# EasyEDA Pro project ProDoc_Schematic1_2024-11-27.epro

# Schematic Schematic1
Board Name: Board1; Create Date: 2024-10-19; Page Name: P1; Project Name: 3070; Schematic Name: Schematic1; Update Date: 2024-10-19; Company: EE3070_L02_Group4; Page Size: A4; Version: V1.0
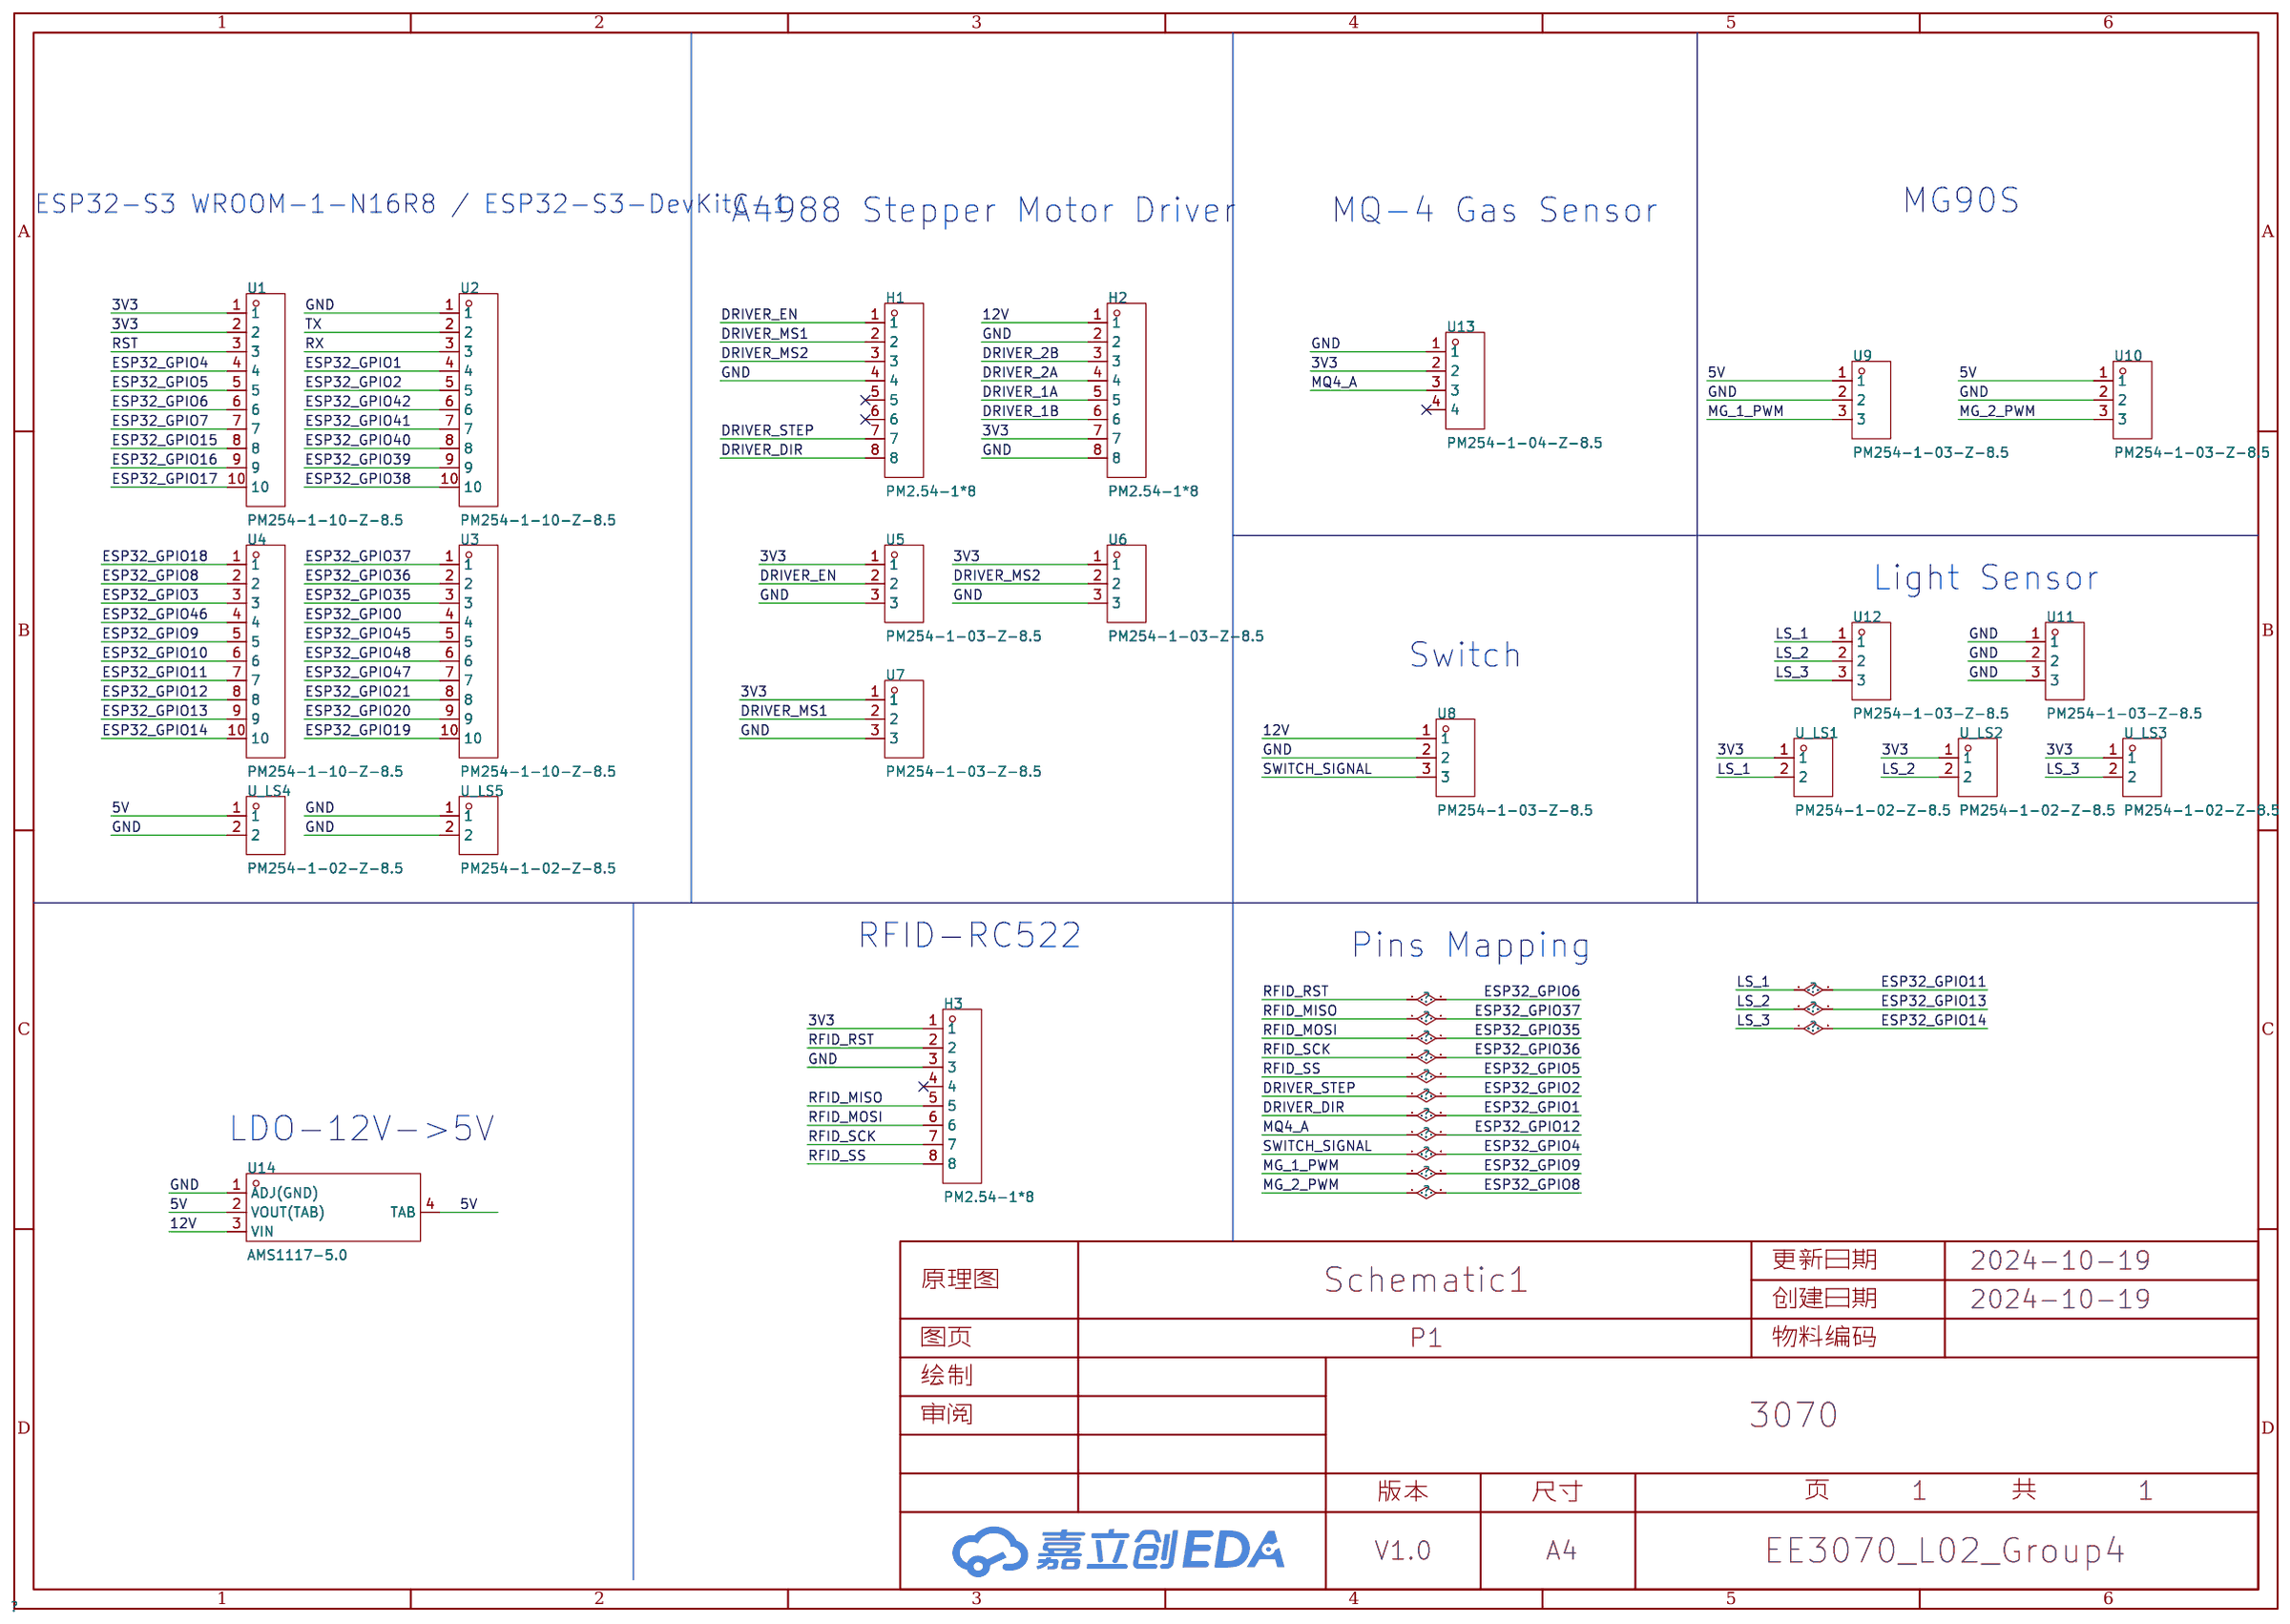
[diagram p0: schematic sheet]

## Parts
H1  PM2.54-1*8  [HDR-TH_8P-P2.54-V-F]
H2  PM2.54-1*8  [HDR-TH_8P-P2.54-V-F]
H3  PM2.54-1*8  [HDR-TH_8P-P2.54-V-F]
U1  PM254-1-10-Z-8.5  [hdr-th_10p-p2.54-v-f]
U2  PM254-1-10-Z-8.5  [hdr-th_10p-p2.54-v-f]
U3  PM254-1-10-Z-8.5  [hdr-th_10p-p2.54-v-f]
U4  PM254-1-10-Z-8.5  [hdr-th_10p-p2.54-v-f]
U5  PM254-1-03-Z-8.5  [HDR-TH_3P-P2.54-V-F]
U6  PM254-1-03-Z-8.5  [HDR-TH_3P-P2.54-V-F]
U7  PM254-1-03-Z-8.5  [HDR-TH_3P-P2.54-V-F]
U8  PM254-1-03-Z-8.5  [HDR-TH_3P-P2.54-V-F]
U9  PM254-1-03-Z-8.5  [HDR-TH_3P-P2.54-V-F]
U10  PM254-1-03-Z-8.5  [HDR-TH_3P-P2.54-V-F]
U11  PM254-1-03-Z-8.5  [HDR-TH_3P-P2.54-V-F]
U12  PM254-1-03-Z-8.5  [HDR-TH_3P-P2.54-V-F]
U13  PM254-1-04-Z-8.5  [HDR-TH_4P-P2.54-V-M]
U14  AMS1117-5.0  [SOT-223_L6.7-W3.5-P2.30-BR]
U_LS1  PM254-1-02-Z-8.5  [HDR-TH_2P-P2.54-V-F]
U_LS2  PM254-1-02-Z-8.5  [HDR-TH_2P-P2.54-V-F]
U_LS3  PM254-1-02-Z-8.5  [HDR-TH_2P-P2.54-V-F]
U_LS4  PM254-1-02-Z-8.5  [HDR-TH_2P-P2.54-V-F]
U_LS5  PM254-1-02-Z-8.5  [HDR-TH_2P-P2.54-V-F]

## Library data of the parts
H1-H3 = PM2.54-1*8: 插孔结构:1x8P;间距:2.54mm;行距:2.54mm;圆孔/方孔:方孔;安装类型:直插;排数:单排;总孔位数:8P;额定电流:2.5A;插孔方向:顶部;塑高:8.5mm;工作温度范围:-40℃~+105℃;; LCSC Part Name: 间距:2.54mm 1x8P 直插; Supplier Part: C5224027; Manufacturer: ZHOURI(洲日); Supplier Footprint: 插件,P=2.54mm; JLCPCB Part Class: 扩展库; Datasheet: https://atta.szlcsc.com/upload/public/pdf/source/20221031/E5BAE727A502DC7C69CE947E807E2296.pdf; Supplier: LCSC; Holes Structure: 1x8P; Pitch: 2.54mm; Row Spacing: 2.54mm; Circular Hole / Square Hole: 方孔; Mounting Type: 直插; Number of Rows: 单排; Number of Holes: 8P; Current Rating (Max): 2.5A; Holes Direction: 顶部; Insulation Height: 8.5mm; Operating Temperature Range: -40℃~+105℃
U1-U4 = PM254-1-10-Z-8.5: 插孔结构:1x10P;间距:2.54mm;行距:-;圆孔/方孔:方孔;安装类型:直插;排数:单排;总孔位数:10P;额定电流:3A;额定电压:-;插孔方向:顶部;塑高:8.5mm;触头材质:铜合金;工作温度范围:-40℃~+105℃;焊接温度(最大值):260℃@5S;; LCSC Part Name: 1x10P 间距:2.54mm 直插; Supplier Part: C2897373; Manufacturer: HCTL(华灿天禄); Supplier Footprint: 插件,P=2.54mm; JLCPCB Part Class: Extended Part; Datasheet: https://atta.szlcsc.com/upload/public/pdf/source/20230609/534BE42964C679BDE98E061007C4ABD6.pdf; Supplier: LCSC; Holes Structure: 1x10P; Pitch: 2.54mm; Circular Hole / Square Hole: 方孔; Mounting Type: 直插; Number of Rows: 单排; Number of Holes: 10P; Current Rating (Max): 3A; Holes Direction: 顶部; Insulation Height: 8.5mm; Contact Material: 铜合金; Operating Temperature Range: -40℃~+105℃; Soldering Temperature(Max): 260℃@5S
U5-U12 = PM254-1-03-Z-8.5: 插孔结构:1x3P;间距:2.54mm;行距:-;圆孔/方孔:方孔;安装类型:直插;排数:单排;总孔位数:3P;额定电流:3A;额定电压:-;插孔方向:顶部;塑高:8.5mm;触头材质:铜合金;工作温度范围:-40℃~+105℃;焊接温度(最大值):260℃@5S;; LCSC Part Name: 1x3P 间距:2.54mm 直插; Supplier Part: C2897366; Manufacturer: HCTL(华灿天禄); Supplier Footprint: 插件,P=2.54mm; JLCPCB Part Class: 扩展库; Datasheet: https://atta.szlcsc.com/upload/public/pdf/source/20230609/534BE42964C679BDE98E061007C4ABD6.pdf; Supplier: LCSC; Holes Structure: 1x3P; Pitch: 2.54mm; Circular Hole / Square Hole: 方孔; Mounting Type: 直插; Number of Rows: 单排; Number of Holes: 3P; Current Rating (Max): 3A; Holes Direction: 顶部; Insulation Height: 8.5mm; Contact Material: 铜合金; Operating Temperature Range: -40℃~+105℃; Soldering Temperature(Max): 260℃@5S
U13 = PM254-1-04-Z-8.5_C2897367: 插孔结构:1x4P;间距:2.54mm;行距:-;圆孔/方孔:方孔;安装类型:直插;排数:单排;总孔位数:4P;额定电流:3A;额定电压:-;插孔方向:顶部;塑高:8.5mm;触头材质:铜合金;工作温度范围:-40℃~+105℃;焊接温度(最大值):260℃@5S;; LCSC Part Name: 1x4P 间距:2.54mm 直插; Supplier Part: C2897367; Manufacturer: HCTL(华灿天禄); Supplier Footprint: 插件,P=2.54mm; JLCPCB Part Class: Extended Part; Datasheet: https://atta.szlcsc.com/upload/public/pdf/source/20230609/534BE42964C679BDE98E061007C4ABD6.pdf; Supplier: LCSC; Holes Structure: 1x4P; Pitch: 2.54mm; Circular Hole / Square Hole: 方孔; Mounting Type: 直插; Number of Rows: 单排; Number of Holes: 4P; Current Rating (Max): 3A; Holes Direction: 顶部; Insulation Height: 8.5mm; Contact Material: 铜合金; Operating Temperature Range: -40℃~+105℃; Soldering Temperature(Max): 260℃@5S
U14 = AMS1117-5.0_C347223: 输出类型:固定;最大输入电压:12V;输出电压:5V;最大输出电流:1A;电源纹波抑制比(PSRR):60dB@(120Hz);输出极性:正极;; LCSC Part Name: 输出:5V 电流:1A 耐压:12V; Supplier Part: C347223; Manufacturer: UMW(友台半导体); Supplier Footprint: SOT-223; JLCPCB Part Class: 扩展库; Datasheet: https://atta.szlcsc.com/upload/public/pdf/source/20231109/155D79A26D9DB04352555A58D5969DC8.pdf; Supplier: LCSC; Output Type: 固定; Maximum Input Voltage: 12V; Output Voltage: 5V; MAX Output Current: 1A; Power Supply Rejection Ratio (PSRR): 60dB@(120Hz); Dropout Voltage: 1.3V@(1A); Output Polarity: 正极; Number of Outputs: 1
U_LS1-U_LS5 = PM254-1-02-Z-8.5: 插孔结构:1x2P;间距:2.54mm;行距:-;圆孔/方孔:方孔;安装类型:直插;排数:单排;总孔位数:2P;额定电流:3A;额定电压:-;插孔方向:顶部;塑高:8.5mm;触头材质:铜合金;工作温度范围:-40℃~+105℃;焊接温度(最大值):260℃@5S;; LCSC Part Name: 1x2P 间距:2.54mm 直插; Supplier Part: C2897365; Manufacturer: HCTL(华灿天禄); Supplier Footprint: 插件,P=2.54mm; JLCPCB Part Class: 扩展库; Datasheet: https://atta.szlcsc.com/upload/public/pdf/source/20230609/534BE42964C679BDE98E061007C4ABD6.pdf; Supplier: LCSC; Holes Structure: 1x2P; Pitch: 2.54mm; Circular Hole / Square Hole: 方孔; Mounting Type: 直插; Number of Rows: 单排; Number of Holes: 2P; Current Rating (Max): 3A; Holes Direction: 顶部; Insulation Height: 8.5mm; Contact Material: 铜合金; Operating Temperature Range: -40℃~+105℃; Soldering Temperature(Max): 260℃@5S

## Nets
3V3: H2.7 H3.1 U1.1 U1.2 U5.1 U6.1 U7.1 U13.2 U_LS1.1 U_LS2.1 U_LS3.1
5V: U9.1 U10.1 U14.2(VOUT(TAB)) U14.4(TAB) U_LS4.1
12V: H2.1 U8.1 U14.3(VIN)
GND: H1.4 H2.2 H2.8 H3.3 U2.1 U5.3 U6.3 U7.3 U8.2 U9.2 U10.2 U11.1 U11.2 U11.3 U13.1 U14.1(ADJ(GND)) U_LS4.2 U_LS5.1 U_LS5.2
DRIVER_1A: H2.5
DRIVER_1B: H2.6
DRIVER_2A: H2.4
DRIVER_2B: H2.3
DRIVER_DIR: H1.8 U2.4
DRIVER_EN: H1.1 U5.2
DRIVER_MS1: H1.2 U7.2
DRIVER_MS2: H1.3 U6.2
DRIVER_STEP: H1.7 U2.5
ESP32_GPIO0: U3.4
ESP32_GPIO3: U4.3
ESP32_GPIO4: U1.4 U8.3
ESP32_GPIO5: H3.8 U1.5
ESP32_GPIO6: H3.2 U1.6
ESP32_GPIO7: U1.7
ESP32_GPIO8: U4.2 U10.3
ESP32_GPIO9: U4.5 U9.3
ESP32_GPIO10: U4.6
ESP32_GPIO11: U4.7 U12.1 U_LS1.2
ESP32_GPIO12: U4.8 U13.3
ESP32_GPIO13: U4.9 U12.2 U_LS2.2
ESP32_GPIO14: U4.10 U12.3 U_LS3.2
ESP32_GPIO15: U1.8
ESP32_GPIO16: U1.9
ESP32_GPIO17: U1.10
ESP32_GPIO18: U4.1
ESP32_GPIO19: U3.10
ESP32_GPIO20: U3.9
ESP32_GPIO21: U3.8
ESP32_GPIO35: H3.6 U3.3
ESP32_GPIO36: H3.7 U3.2
ESP32_GPIO37: H3.5 U3.1
ESP32_GPIO38: U2.10
ESP32_GPIO39: U2.9
ESP32_GPIO40: U2.8
ESP32_GPIO41: U2.7
ESP32_GPIO42: U2.6
ESP32_GPIO45: U3.5
ESP32_GPIO46: U4.4
ESP32_GPIO47: U3.7
ESP32_GPIO48: U3.6
RST: U1.3
RX: U2.3
TX: U2.2

Not connected (* = marked no-connect by the designer): H1 5* 6*; H3 4*; U13 4*

## Notes on the sheet
- ESP32-S3 WROOM-1-N16R8 / ESP32-S3-DevKitC-1
- A4988 Stepper Motor Driver
- MQ-4 Gas Sensor
- MG90S
- Light Sensor
- Switch
- RFID-RC522
- Pins Mapping
- LDO-12V->5V
